# Altium schematic sheet Cover Page.SchDoc
size A4; DocumentNumber: 1; SheetNumber: 1; SheetTotal: 3
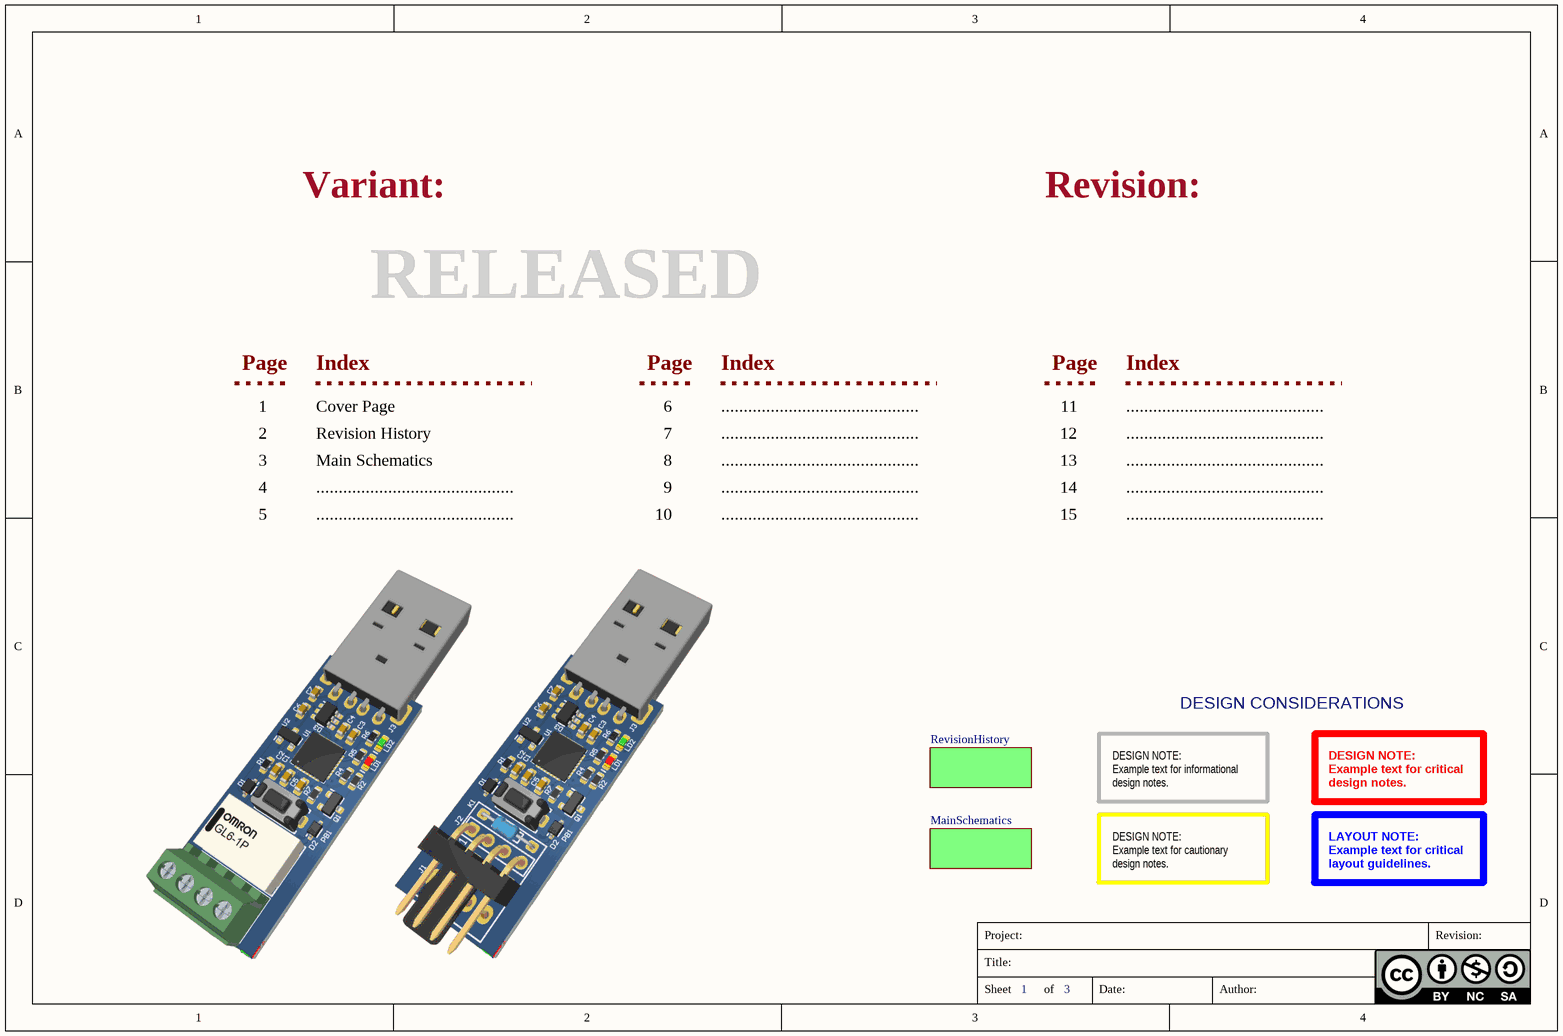
[diagram p0: Cover Page.SchDoc]

## Sub-sheets
MainSchematics = Main Schematics.SchDoc: no entries
RevisionHistory = Revision History.SchDoc: no entries

## Notes on the sheet
- Variant:
- Revision:
- RELEASED
- Page
- Index
- 1
- 2
- Cover Page
- Revision History
- 6
- 7
- ............................................
- 11
- 12
- 3
- 4
- 5
- Main Schematics
- 8
- 9
- 10
- 13
- 14
- 15
- DESIGN CONSIDERATIONS
- DESIGN NOTE:
  Example text for informational
  design notes.
- DESIGN NOTE:
  Example text for critical
  design notes.
- DESIGN NOTE:
  Example text for cautionary
  design notes.
- LAYOUT NOTE:
  Example text for critical
  layout guidelines.
- Title:
- Project:
- Sheet
- of
- Date:
- Author: